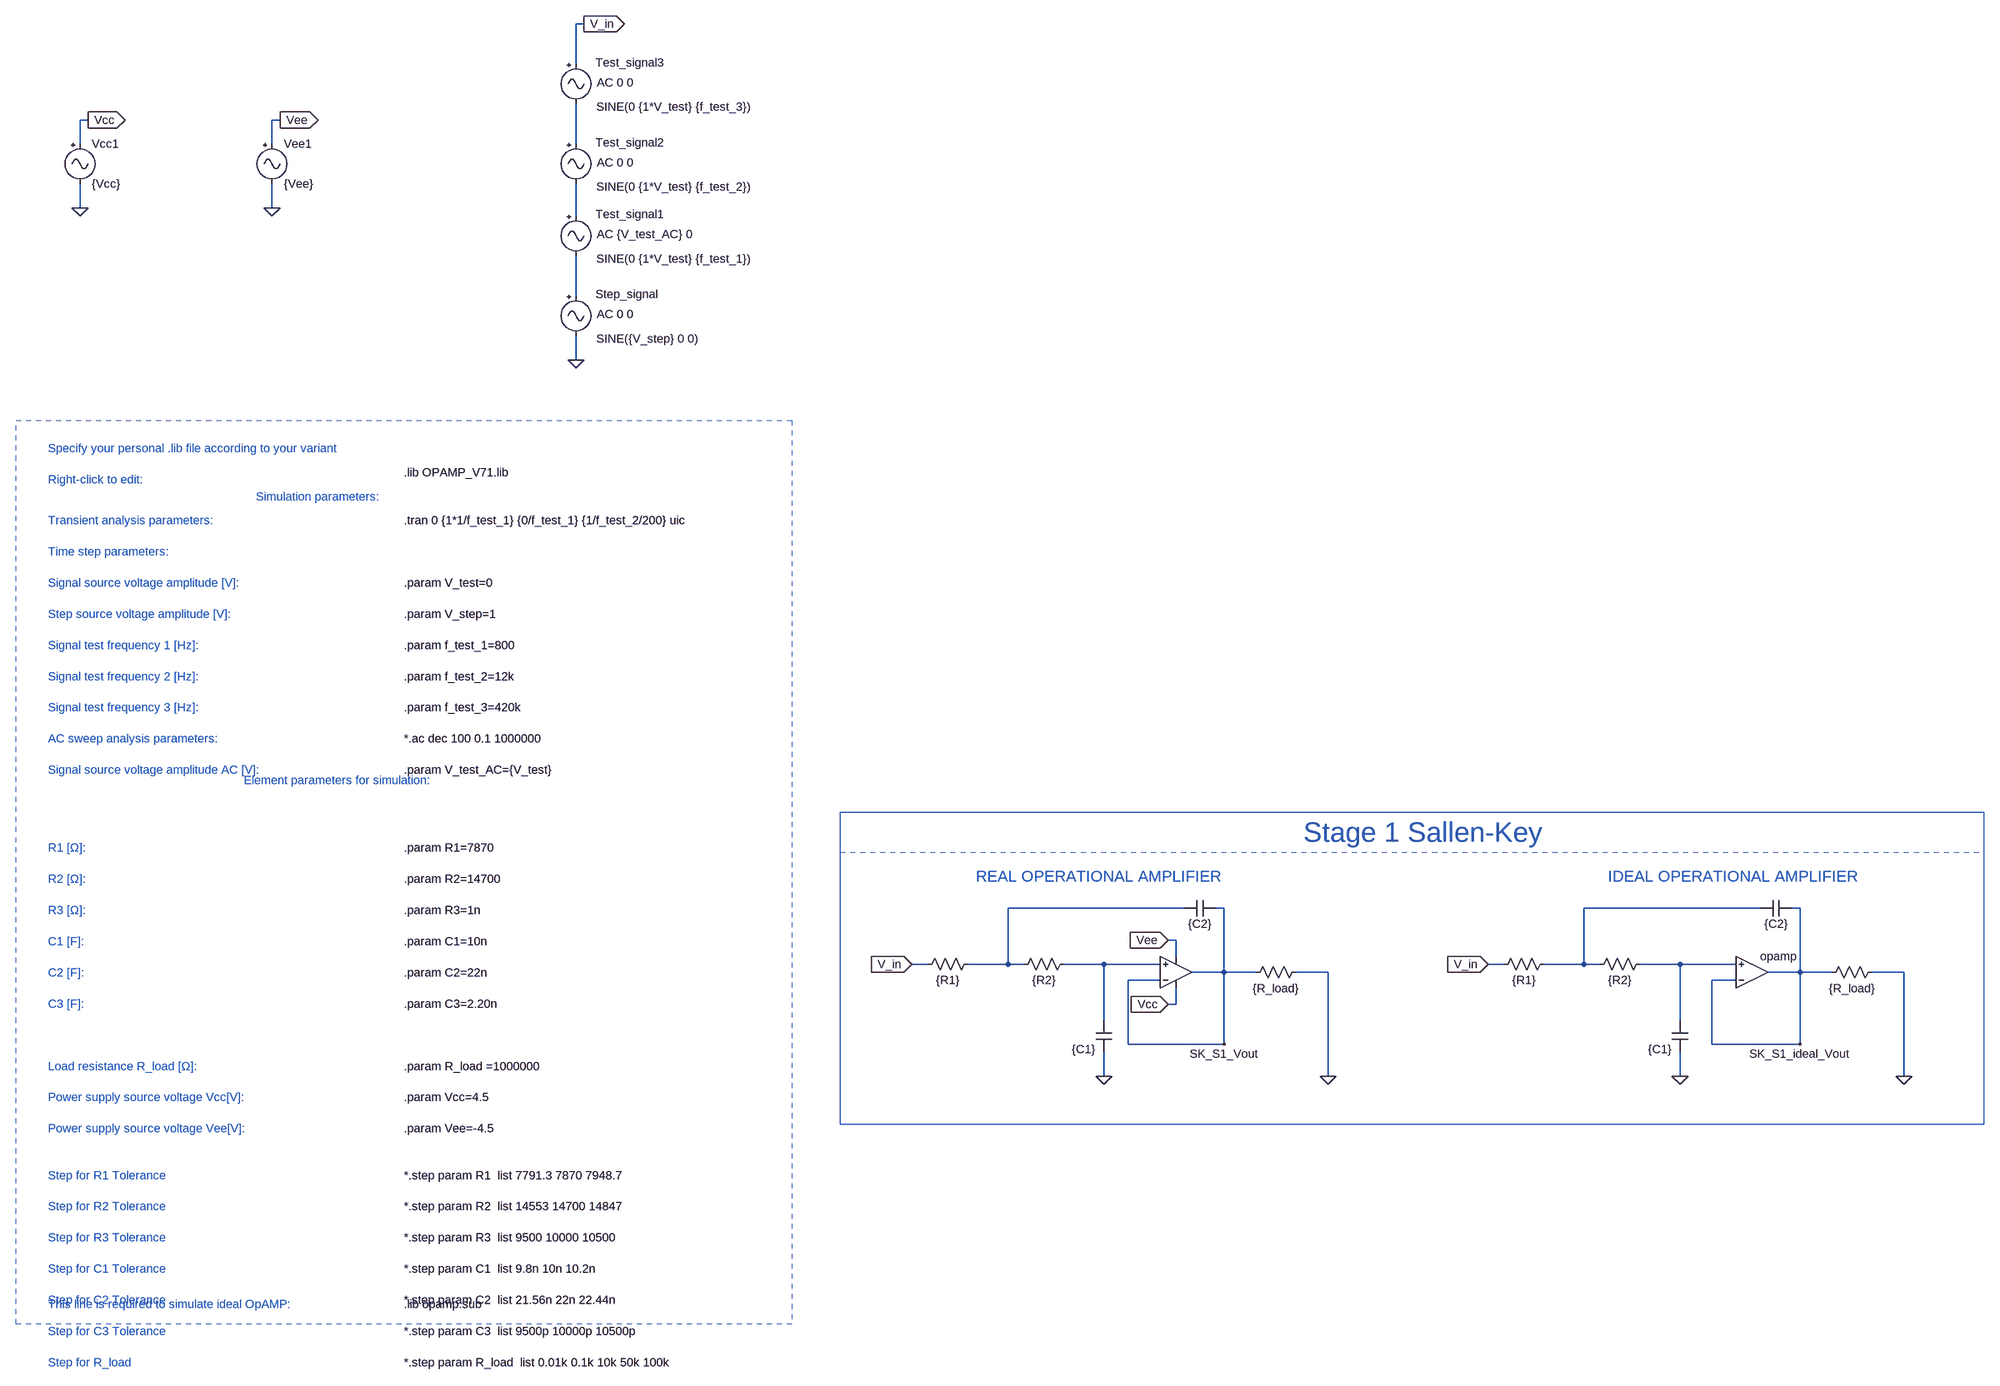
[diagram p0: schematic Lab3. OpAmp_Filter.asc]
Lab3. OpAmp_Filter.asc, the LTspice schematic file:
Version 4
SHEET 1 6772 2844
WIRE -1024 -1424 -1040 -1424
WIRE -1040 -1344 -1040 -1424
WIRE -2016 -1232 -2032 -1232
WIRE -1632 -1232 -1648 -1232
WIRE -2032 -1184 -2032 -1232
WIRE -1648 -1184 -1648 -1232
WIRE -1040 -1184 -1040 -1264
WIRE -2032 -1056 -2032 -1104
WIRE -1648 -1056 -1648 -1104
WIRE -1040 -1040 -1040 -1104
WIRE -1040 -880 -1040 -960
WIRE -1040 -752 -1040 -800
WIRE 176 352 -176 352
WIRE 256 352 240 352
WIRE 1328 352 976 352
WIRE 1408 352 1392 352
WIRE 160 416 144 416
WIRE 160 448 160 416
WIRE -336 464 -368 464
WIRE -176 464 -176 352
WIRE -176 464 -256 464
WIRE -144 464 -176 464
WIRE 16 464 -64 464
WIRE 128 464 16 464
WIRE 816 464 784 464
WIRE 976 464 976 352
WIRE 976 464 896 464
WIRE 1008 464 976 464
WIRE 1168 464 1088 464
WIRE 1280 464 1168 464
WIRE 256 480 256 352
WIRE 256 480 192 480
WIRE 320 480 256 480
WIRE 464 480 400 480
WIRE 1408 480 1408 352
WIRE 1408 480 1344 480
WIRE 1472 480 1408 480
WIRE 1616 480 1552 480
WIRE 128 496 64 496
WIRE 1280 496 1232 496
WIRE 160 544 160 512
WIRE 160 544 144 544
WIRE 16 576 16 464
WIRE 1168 576 1168 464
WIRE 64 624 64 496
WIRE 256 624 256 480
WIRE 256 624 64 624
WIRE 1232 624 1232 496
WIRE 1408 624 1408 480
WIRE 1408 624 1232 624
WIRE 16 688 16 640
WIRE 464 688 464 480
WIRE 1168 688 1168 640
WIRE 1616 688 1616 480
FLAG 16 688 0
FLAG 144 544 Vcc
IOPIN 144 544 In
FLAG 144 416 Vee
IOPIN 144 416 In
FLAG 256 624 SK_S1_Vout
FLAG -368 464 V_in
IOPIN -368 464 In
FLAG 464 688 0
FLAG 1168 688 0
FLAG 1408 624 SK_S1_ideal_Vout
FLAG 784 464 V_in
IOPIN 784 464 In
FLAG 1616 688 0
FLAG -2032 -1056 0
FLAG -1648 -1056 0
FLAG -2016 -1232 Vcc
IOPIN -2016 -1232 Out
FLAG -1632 -1232 Vee
IOPIN -1632 -1232 Out
FLAG -1040 -752 0
FLAG -1024 -1424 V_in
IOPIN -1024 -1424 Out
SYMBOL OpAmps\\opamp2 160 544 M180
WINDOW 0 16 32 Invisible 2
WINDOW 3 16 96 Invisible 2
SYMATTR InstName U6
SYMATTR Value OPAMP_VarNo
SYMBOL res -240 448 R90
WINDOW 0 0 56 Invisible 2
WINDOW 3 32 56 VTop 2
SYMATTR InstName R_9
SYMATTR Value {R1}
SYMBOL res -48 448 R90
WINDOW 0 0 56 Invisible 2
WINDOW 3 32 56 VTop 2
SYMATTR InstName R_10
SYMATTR Value {R2}
SYMBOL res 416 464 R90
WINDOW 0 0 56 Invisible 2
WINDOW 3 33 56 VTop 2
SYMATTR InstName R38
SYMATTR Value {R_load}
SYMBOL cap 0 576 R0
WINDOW 0 24 8 Invisible 2
WINDOW 3 -48 58 Left 2
SYMATTR InstName C_11
SYMATTR Value {C1}
SYMBOL cap 240 336 R90
WINDOW 0 0 32 Invisible 2
WINDOW 3 32 32 VTop 2
SYMATTR InstName C_12
SYMATTR Value {C2}
SYMBOL res 912 448 R90
WINDOW 0 0 56 Invisible 2
WINDOW 3 32 56 VTop 2
SYMATTR InstName R_12
SYMATTR Value {R1}
SYMBOL res 1104 448 R90
WINDOW 0 0 56 Invisible 2
WINDOW 3 32 56 VTop 2
SYMATTR InstName R_14
SYMATTR Value {R2}
SYMBOL res 1568 464 R90
WINDOW 0 0 56 Invisible 2
WINDOW 3 33 56 VTop 2
SYMATTR InstName R39
SYMATTR Value {R_load}
SYMBOL cap 1152 576 R0
WINDOW 0 24 8 Invisible 2
WINDOW 3 -48 58 Left 2
SYMATTR InstName C_15
SYMATTR Value {C1}
SYMBOL cap 1392 336 R90
WINDOW 0 0 32 Invisible 2
WINDOW 3 32 32 VTop 2
SYMATTR InstName C_16
SYMATTR Value {C2}
SYMBOL OpAmps\\opamp 1312 544 M180
WINDOW 0 0 32 Invisible 2
SYMATTR InstName U7
SYMBOL Misc\\signal -1040 -896 R0
WINDOW 123 42 53 Left 2
WINDOW 39 0 0 Left 0
WINDOW 0 39 13 Left 2
WINDOW 3 41 102 Left 2
SYMATTR Value2 AC 0 0
SYMATTR InstName Step_signal
SYMATTR Value SINE({V_step} 0 0)
SYMBOL Misc\\signal -1648 -1200 R0
WINDOW 123 0 0 Left 0
WINDOW 39 0 0 Left 0
SYMATTR InstName Vee1
SYMATTR Value {Vee}
SYMBOL Misc\\signal -2032 -1200 R0
WINDOW 123 0 0 Left 0
WINDOW 39 0 0 Left 0
SYMATTR InstName Vcc1
SYMATTR Value {Vcc}
SYMBOL Misc\\signal -1040 -1200 R0
WINDOW 123 42 53 Left 2
WINDOW 39 0 0 Left 0
WINDOW 0 39 13 Left 2
WINDOW 3 41 102 Left 2
SYMATTR Value2 AC 0 0
SYMATTR InstName Test_signal2
SYMATTR Value SINE(0 {1*V_test} {f_test_2})
SYMBOL Misc\\signal -1040 -1360 R0
WINDOW 123 42 53 Left 2
WINDOW 39 0 0 Left 0
WINDOW 0 39 13 Left 2
WINDOW 3 41 102 Left 2
SYMATTR Value2 AC 0 0
SYMATTR InstName Test_signal3
SYMATTR Value SINE(0 {1*V_test} {f_test_3})
SYMBOL Misc\\signal -1040 -1056 R0
WINDOW 123 42 53 Left 2
WINDOW 39 0 0 Left 0
WINDOW 0 39 13 Left 2
WINDOW 3 41 102 Left 2
SYMATTR Value2 AC {V_test_AC} 0
SYMATTR InstName Test_signal1
SYMATTR Value SINE(0 {1*V_test} {f_test_1})
TEXT 1024 288 Left 3 ;IDEAL OPERATIONAL AMPLIFIER
TEXT -240 288 Left 3 ;REAL OPERATIONAL AMPLIFIER
TEXT 656 200 Center 5 ;Stage 1 Sallen-Key
TEXT -1384 -424 Left 2 !.tran 0 {1*1/f_test_1} {0/f_test_1} {1/f_test_2/200} uic\n \n \n \n.param V_test=0\n \n.param V_step=1\n \n.param f_test_1=800\n \n.param f_test_2=12k\n \n.param f_test_3=420k\n \n*.ac dec 100 0.1 1000000\n \n.param V_test_AC={V_test}\n \n \n \n  \n.param R1=7870\n \n.param R2=14700\n \n.param R3=1n\n \n.param C1=10n\n \n.param C2=22n\n \n.param C3=2.20n\n \n \n \n.param R_load =1000000\n \n.param Vcc=4.5\n \n.param Vee=-4.5\n \n  \n*.step param R1  list 7791.3 7870 7948.7 \n \n*.step param R2  list 14553 14700 14847\n \n*.step param R3  list 9500 10000 10500\n \n*.step param C1  list 9.8n 10n 10.2n\n \n*.step param C2  list 21.56n 22n 22.44n\n \n*.step param C3  list 9500p 10000p 10500p\n \n*.step param R_load  list 0.01k 0.1k 10k 50k 100k
TEXT -1384 -520 Left 2 !.lib OPAMP_V71.lib
TEXT -2096 -568 Left 2 ;Specify your personal .lib file according to your variant\n \nRight-click to edit:
TEXT -1680 -472 Left 2 ;Simulation parameters:
TEXT -1704 96 Left 2 ;Element parameters for simulation:
TEXT -2096 -424 Left 2 ;Transient analysis parameters:\n \nTime step parameters:\n \nSignal source voltage amplitude [V]:\n \nStep source voltage amplitude [V]:\n \nSignal test frequency 1 [Hz]:\n \nSignal test frequency 2 [Hz]:\n \nSignal test frequency 3 [Hz]:\n \nAC sweep analysis parameters:\n \nSignal source voltage amplitude AC [V]:\n  \n \n \n \nR1 [Ω]:\n \nR2 [Ω]:\n \nR3 [Ω]:\n \nC1 [F]:\n \nC2 [F]:\n \nC3 [F]:\n \n \n \nLoad resistance R_load [Ω]:\n \nPower supply source voltage Vcc[V]:\n \nPower supply source voltage Vee[V]: \n \n \nStep for R1 Tolerance\n \nStep for R2 Tolerance\n \nStep for R3 Tolerance\n \nStep for C1 Tolerance \n \nStep for C2 Tolerance\n \nStep for C3 Tolerance \n \nStep for R_load
TEXT -1384 1144 Left 2 !.lib opamp.sub
TEXT -2096 1144 Left 2 ;This line is required to simulate ideal OpAMP:
RECTANGLE Normal 1776 784 -512 240 2
RECTANGLE Normal -512 160 1776 784
RECTANGLE Normal -608 1184 -2160 -624 2

The netlist it stands for:
* Lab3. OpAmp_Filter.asc
XU6 N006 SK_S1_Vout Vcc Vee SK_S1_Vout OPAMP_VarNo  ; pins In+ In- V+ V- OUT
R_9 N004 V_in {R1}
R_10 N006 N004 {R2}
R38 0 SK_S1_Vout {R_load}
C_11 N006 0 {C1}
C_12 SK_S1_Vout N004 {C2}
R_12 N005 V_in {R1}
R_14 N007 N005 {R2}
R39 0 SK_S1_ideal_Vout {R_load}
C_15 N007 0 {C1}
C_16 SK_S1_ideal_Vout N005 {C2}
XU7 SK_S1_ideal_Vout N007 SK_S1_ideal_Vout opamp Aol=100K GBW=10Meg  ; pins invin noninvin out
V§Step_signal N003 0 SINE({V_step} 0 0) AC 0 0
Vee1 Vee 0 {Vee}
Vcc1 Vcc 0 {Vcc}
V§Test_signal2 N001 N002 SINE(0 {1*V_test} {f_test_2}) AC 0 0
V§Test_signal3 V_in N001 SINE(0 {1*V_test} {f_test_3}) AC 0 0
V§Test_signal1 N002 N003 SINE(0 {1*V_test} {f_test_1}) AC {V_test_AC} 0
* IDEAL OPERATIONAL AMPLIFIER
* REAL OPERATIONAL AMPLIFIER
* Stage 1 Sallen-Key
.tran 0 {1*1/f_test_1} {0/f_test_1} {1/f_test_2/200} uic
.param V_test=0
.param V_step=1
.param f_test_1=800
.param f_test_2=12k
.param f_test_3=420k
*.ac dec 100 0.1 1000000
.param V_test_AC={V_test}
.param R1=7870
.param R2=14700
.param R3=1n
.param C1=10n
.param C2=22n
.param C3=2.20n
.param R_load =1000000
.param Vcc=4.5
.param Vee=-4.5
*.step param R1  list 7791.3 7870 7948.7
*.step param R2  list 14553 14700 14847
*.step param R3  list 9500 10000 10500
*.step param C1  list 9.8n 10n 10.2n
*.step param C2  list 21.56n 22n 22.44n
*.step param C3  list 9500p 10000p 10500p
*.step param R_load  list 0.01k 0.1k 10k 50k 100k
.lib OPAMP_V71.lib
* Specify your personal .lib file according to your variant
* Right-click to edit:
* Simulation parameters:
* Element parameters for simulation:
* Transient analysis parameters:
* Time step parameters:
* Signal source voltage amplitude [V]:
* Step source voltage amplitude [V]:
* Signal test frequency 1 [Hz]:
* Signal test frequency 2 [Hz]:
* Signal test frequency 3 [Hz]:
* AC sweep analysis parameters:
* Signal source voltage amplitude AC [V]:
* R1 [Ω]:
* R2 [Ω]:
* R3 [Ω]:
* C1 [F]:
* C2 [F]:
* C3 [F]:
* Load resistance R_load [Ω]:
* Power supply source voltage Vcc[V]:
* Power supply source voltage Vee[V]:
* Step for R1 Tolerance
* Step for R2 Tolerance
* Step for R3 Tolerance
* Step for C1 Tolerance
* Step for C2 Tolerance
* Step for C3 Tolerance
* Step for R_load
.lib opamp.sub
* This line is required to simulate ideal OpAMP:
.backanno
.end

* Results of the author's LTspice run, read from the files saved beside the schematic
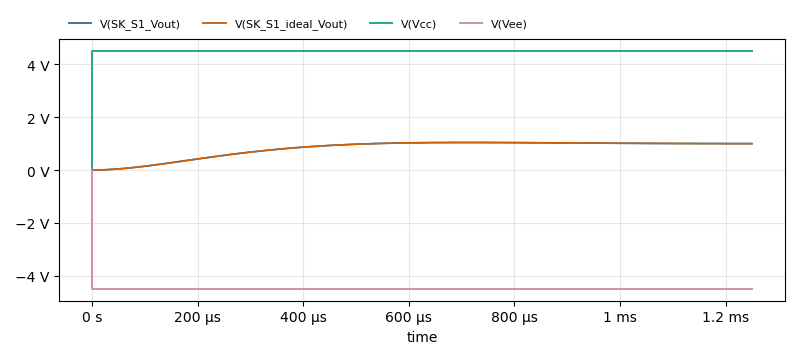
[diagram p1: Transient Analysis of Lab3. OpAmp_Filter.asc, plotted from the saved traces]
* Transient Analysis, 1 run:
*   V(SK_S1_Vout): min -912.7 µV, max 1.043 V, average 819.7 mV, rms 880.3 mV, last 999.8 mV
*   V(SK_S1_ideal_Vout): min 0 V, max 1.043 V, average 819.7 mV, rms 880.4 mV, last 999.8 mV
*   V(Vcc): min 0 V, max 4.5 V, average 4.5 V, rms 4.5 V, last 4.5 V
*   V(Vee): min -4.5 V, max 0 V, average -4.5 V, rms 4.5 V, last -4.5 V